# Altium project SM2200_POWER.PrjPcb
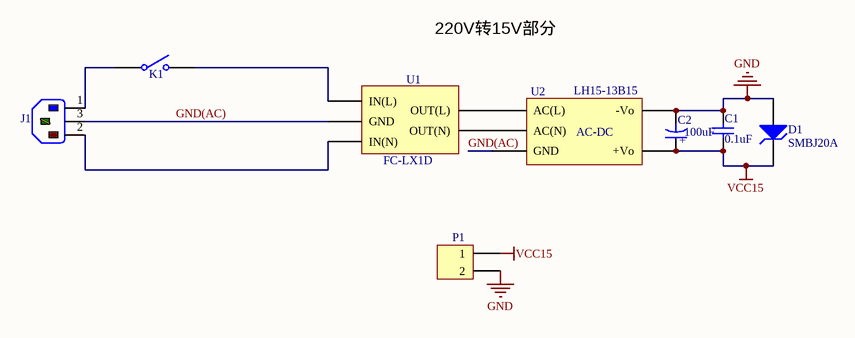
[diagram p0: HighPower.SchDoc]
1 sheet, 8 parts. Net scope: global (net labels, ports and power ports of the same name join across sheets).
Board file: HighPower.PcbDoc

## Sheet HighPower.SchDoc
size A4

### Parts
C1  value 0.1uF  [0805]  (hidden comment: Capacitor-0805)
C2  value 100uF  [贴片铝电容-8*10.3]  (hidden comment: 电解电容)
D1  SMBJ20A  [SMBJ20A]
J1  三脚航空插头  [三脚航空插头]  (value not drawn)
K1  开关  [T型接头]  (value not drawn)
P1  端子2  [MOLEX-2]  (value not drawn)
U1  FC-LX1D  [FC-LX1D]
U2  Describe: AC-DC  Name: LH15-13B15  [LH10-10B15]  (hidden comment: LH10-10B15)

### Nets
GND: C1.2 C2.1 D1.1(A) P1.2 U2.4(-Vo)
VCC15: C1.1 C2.2 D1.2(K) P1.1 U2.8(+Vo)
GND(AC): J1.3 U1.1(GND) U2.1(GND)
NetJ1_1: J1.1 K1.1(COMMON)
NetJ1_2: J1.2 U1.2(IN(N))
NetK1_2: K1.2(NO) U1.3(IN(L))
NetU1_4: U1.4(OUT(L)) U2.3(AC(L))
NetU1_5: U1.5(OUT(N)) U2.2(AC(N))

### Notes on the sheet
- 220V转15V部分
- (in symbol 电解电容) +

### Library data of the parts
D1 = SMBJ20A: Name: SMBJ20A
U1 = FC-LX1D: Name: FC-LX1D